# Altium schematic sheet Sheet2.SchDoc
size A3
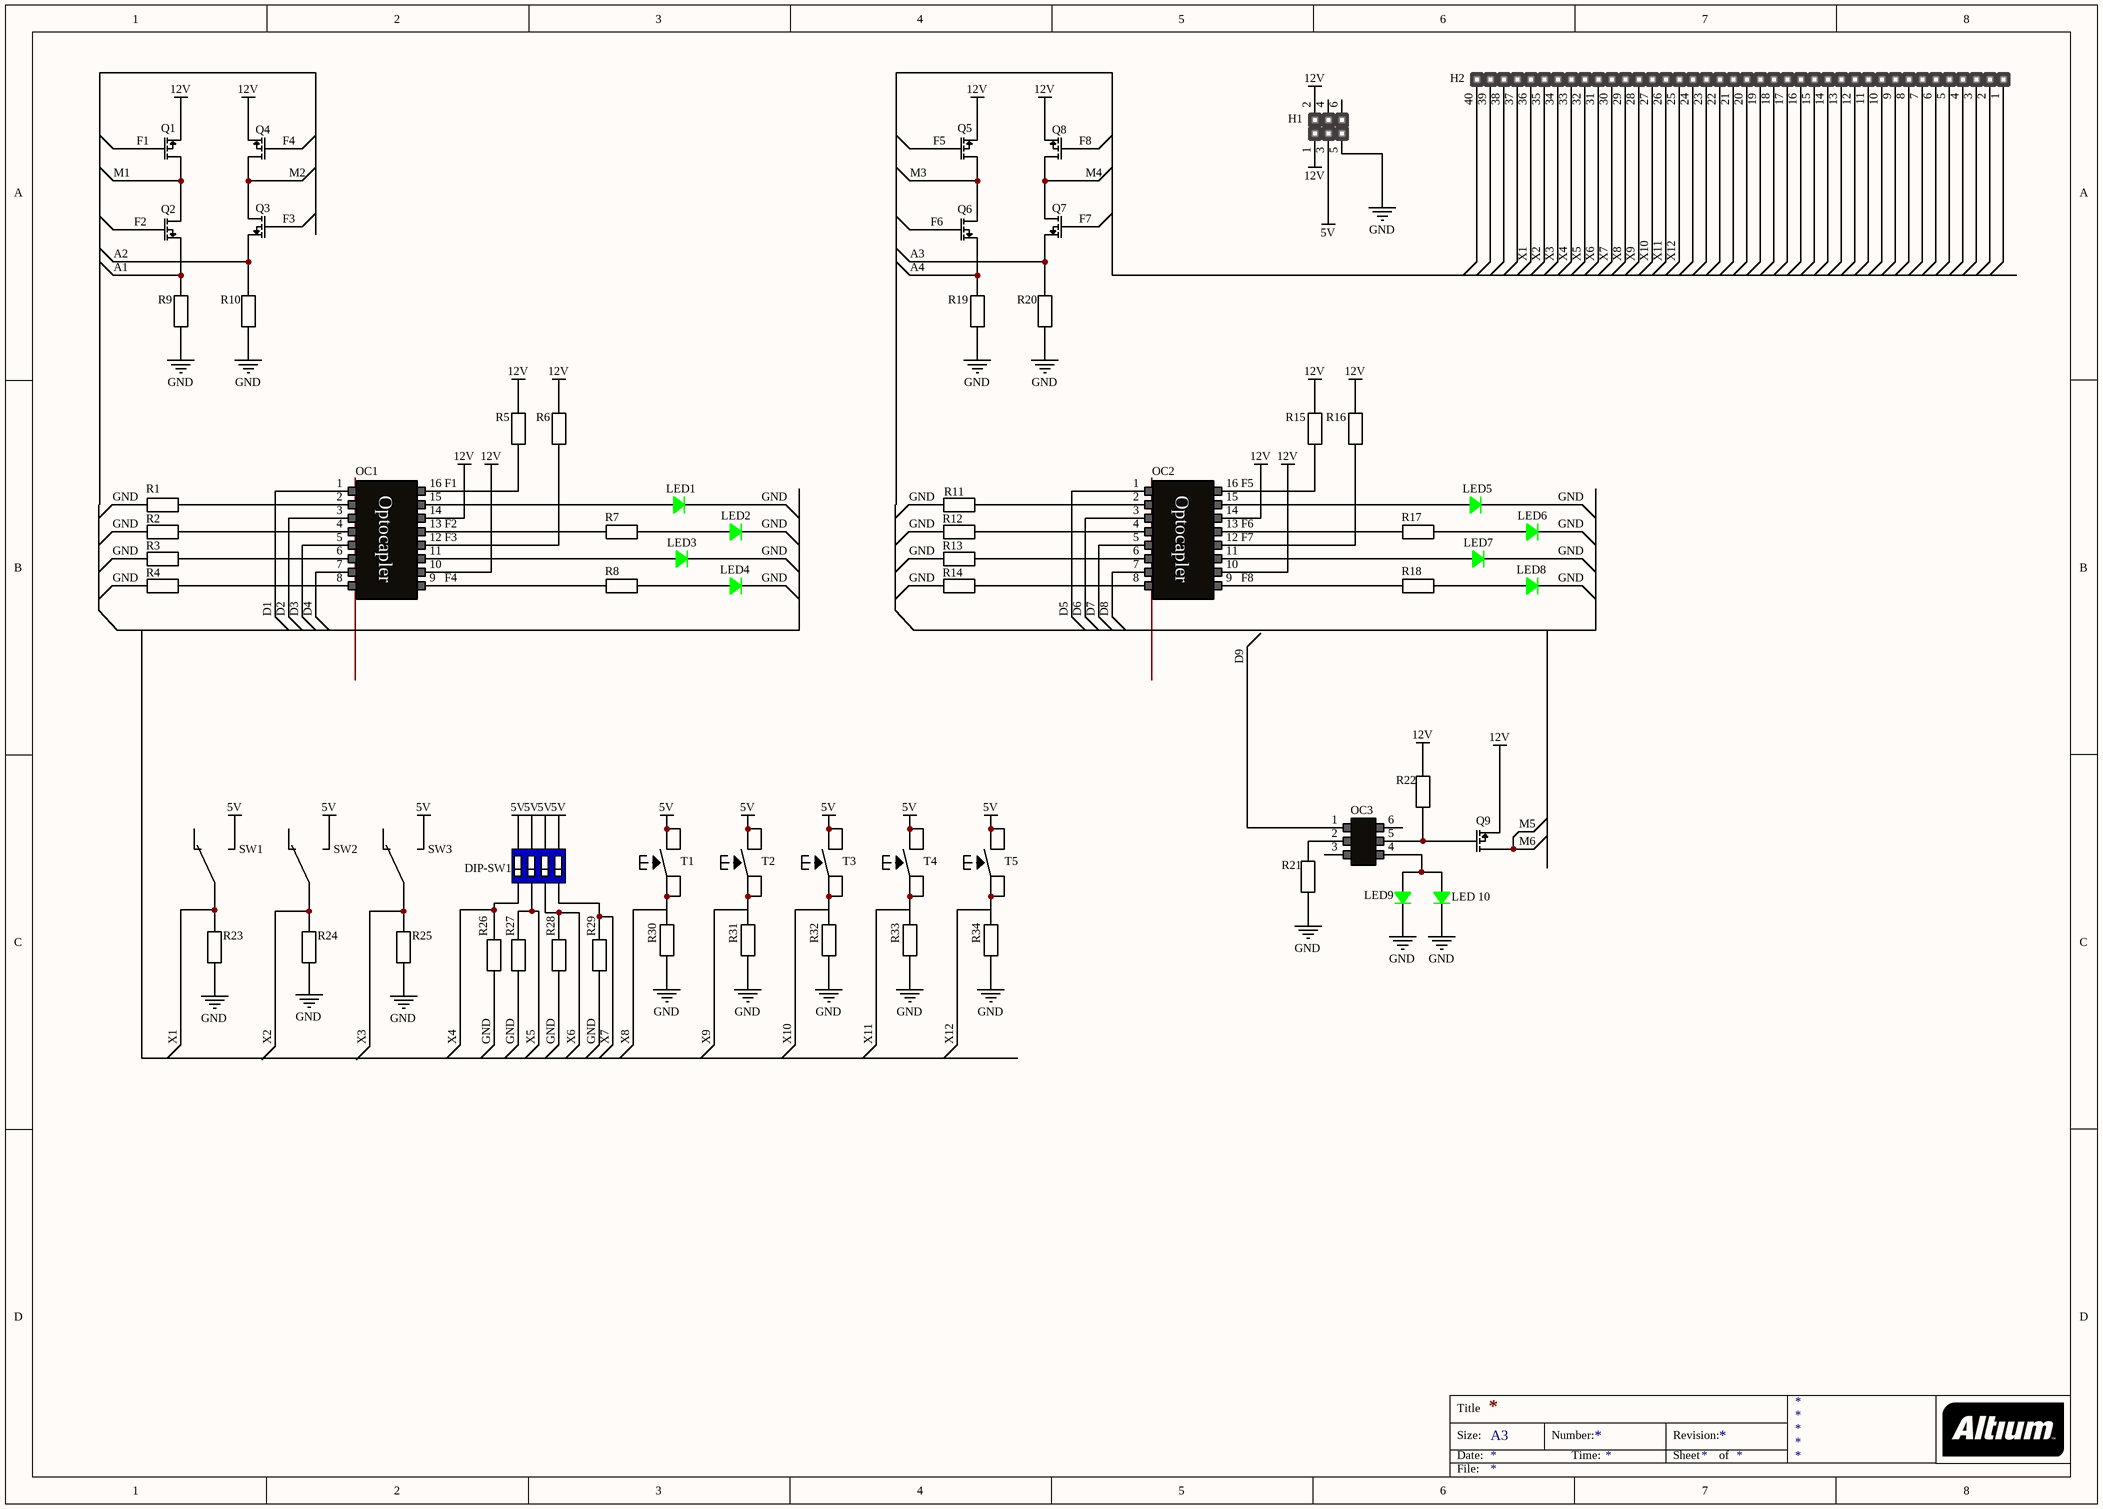
[diagram p0: Sheet2.SchDoc]

## Parts
DIP-SW1  (no value)
H1  (no value)
H2  (no value)
LED1  (no value)  [LED(3mm)]
LED2  (no value)  [LED(3mm)]
LED3  (no value)  [LED(3mm)]
LED4  (no value)  [LED(3mm)]
LED5  (no value)  [LED(3mm)]
LED6  (no value)  [LED(3mm)]
LED7  (no value)  [LED(3mm)]
LED8  (no value)  [LED(3mm)]
LED9  (no value)  [LED(3mm)]
LED_10  (no value)  [LED(3mm)]
OC1  (no value)
OC2  (no value)
OC3  (no value)
Q1  (no value)
Q2  (no value)
Q3  (no value)
Q4  (no value)
Q5  (no value)
Q6  (no value)
Q7  (no value)
Q8  (no value)
Q9  (no value)
R1  (no value)  [R1(200milsa)]
R2  (no value)  [R1(200milsa)]
R3  (no value)  [R1(200milsa)]
R4  (no value)  [R1(200milsa)]
R5  (no value)  [R1(200milsa)]
R6  (no value)  [R1(200milsa)]
R7  (no value)  [R1(200milsa)]
R8  (no value)  [R1(200milsa)]
R9  (no value)  [R1(200milsa)]
R10  (no value)  [R1(200milsa)]
R11  (no value)  [R1(200milsa)]
R12  (no value)  [R1(200milsa)]
R13  (no value)  [R1(200milsa)]
R14  (no value)  [R1(200milsa)]
R15  (no value)  [R1(200milsa)]
R16  (no value)  [R1(200milsa)]
R17  (no value)  [R1(200milsa)]
R18  (no value)  [R1(200milsa)]
R19  (no value)  [R1(200milsa)]
R20  (no value)  [R1(200milsa)]
R21  (no value)  [R1(200milsa)]
R22  (no value)  [R1(200milsa)]
R23  (no value)  [R1(200milsa)]
R24  (no value)  [R1(200milsa)]
R25  (no value)  [R1(200milsa)]
R26  (no value)  [R1(200milsa)]
R27  (no value)  [R1(200milsa)]
R28  (no value)  [R1(200milsa)]
R29  (no value)  [R1(200milsa)]
R30  (no value)  [R1(200milsa)]
R31  (no value)  [R1(200milsa)]
R32  (no value)  [R1(200milsa)]
R33  (no value)  [R1(200milsa)]
R34  (no value)  [R1(200milsa)]
SW1  (no value)
SW2  (no value)
SW3  (no value)
T1  (no value)
T2  (no value)
T3  (no value)
T4  (no value)
T5  (no value)

## Nets
5V: DIP-SW1.5 DIP-SW1.6 DIP-SW1.7 DIP-SW1.8 H1.3 SW1.3 SW2.3 SW3.3 T1.1 T1.2 T2.1 T2.2 T3.1 T3.2 T4.1 T4.2 T5.1 T5.2
12V: H1.1 H1.2 OC1.10 OC1.14 OC2.10 OC2.14 Q1.2 Q4.3 Q5.2 Q8.3 Q9.2 R5.2 R6.2 R15.2 R16.2 R22.1
GND: H1.5 LED1.2 LED2.2 LED3.2 LED4.2 LED5.2 LED6.2 LED7.2 LED8.2 LED9.2 LED_10.2 R1.2 R2.1 R3.1 R4.1 R9.1 R10.1 R11.1 R12.1 R13.1 R14.1 R19.1 R20.1 R21.2 R23.1 R25.1 R26.1 R27.1 R28.1 R29.1 R30.1 R31.1 R32.1 R33.1 R34.1
A1: Q2.3 R9.2
A2: Q3.2 R10.2
A3: Q7.2 R20.2
A4: Q6.3 R19.2
D1: OC1.1
D2: OC1.3
D3: OC1.5
D4: OC1.7
D5: OC2.1
D6: OC2.3
D7: OC2.5
D8: OC2.7
D9: OC3.1
F1: OC1.16 Q1.1 R5.1
F2: OC1.13 Q2.1 R7.1
F3: OC1.12 Q3.1 R6.1
F4: OC1.9 Q4.1 R8.1
F5: OC2.16 Q5.1 R15.1
F6: OC2.13 Q6.1 R17.1
F7: OC2.12 Q7.1 R16.1
F8: OC2.9 Q8.1 R18.1
M1: Q1.3 Q2.2
M2: Q3.3 Q4.2
M3: Q5.3 Q6.2
M4: Q7.3 Q8.2
M5: Q9.3  [also labelled M6]
X1: H2.36 R23.2 SW1.2
X2: H2.35 R24.2 SW2.2
X3: H2.34 R25.2 SW3.2
X4: DIP-SW1.1 H2.33 R26.2
X5: DIP-SW1.2 H2.32 R27.2
X6: DIP-SW1.3 H2.31 R28.2
X7: DIP-SW1.4 H2.30 R29.2
X8: H2.29
X9: H2.28
X10: H2.27
X11: H2.26
X12: H2.25
NetLED1_1: LED1.1 OC1.15
NetLED2_1: LED2.1 R7.2
NetLED3_1: LED3.1 OC1.11
NetLED4_1: LED4.1 R8.2
NetLED5_1: LED5.1 OC2.15
NetLED6_1: LED6.1 R17.2
NetLED7_1: LED7.1 OC2.11
NetLED8_1: LED8.1 R18.2
NetLED9_1: LED9.1 LED_10.1 OC3.4
NetOC1_2: OC1.2 R1.1
NetOC1_4: OC1.4 R2.2
NetOC1_6: OC1.6 R3.2
NetOC1_8: OC1.8 R4.2
NetOC2_2: OC2.2 R11.2
NetOC2_4: OC2.4 R12.2
NetOC2_6: OC2.6 R13.2
NetOC2_8: OC2.8 R14.2
NetOC3_2: OC3.2 R21.1
NetOC3_5: OC3.5 Q9.1 R22.2
NetR30_2: R30.2 T1.3 T1.4
NetR31_2: R31.2 T2.3 T2.4
NetR32_2: R32.2 T3.3 T3.4
NetR33_2: R33.2 T4.3 T4.4
NetR34_2: R34.2 T5.3 T5.4

Not connected (* = marked no-connect by the designer): H1 4 6; H2 1 2 3 4 5 6 7 8 9 10 11 12 13 14 15 16 17 18 19 20 21 22 23 24 37 38 39 40; OC3 3 6; R24 1; SW1 1; SW2 1; SW3 1

## Notes on the sheet
- Labels drawn without touching a wire or pin: GND
- Title
- Size:
- Date:
- A3
- Number:
- Time:
- Revision:
- Sheet
- of
- File:
- (in symbol DIP16) Optocapler

## Library data of the parts
DIP-SW1 = DIP-SW4
H1 = Header2x3
H2 = HEADER1X40
LED1-LED9 LED_10 = LED
OC1 OC2 = DIP16
OC3 = DIP6
Q1 Q3 Q5 Q7 Q9 = FET
Q2 Q4 Q6 Q8 = FET2
R1-R34 = R1
SW1-SW3 = SW
T1-T5 = Taster